# Altium project TestBoard.PrjPcb (part 4 of 5)

## Sheet Supply.SchDoc
size A4; SheetNumber: 2; SheetTotal: 3
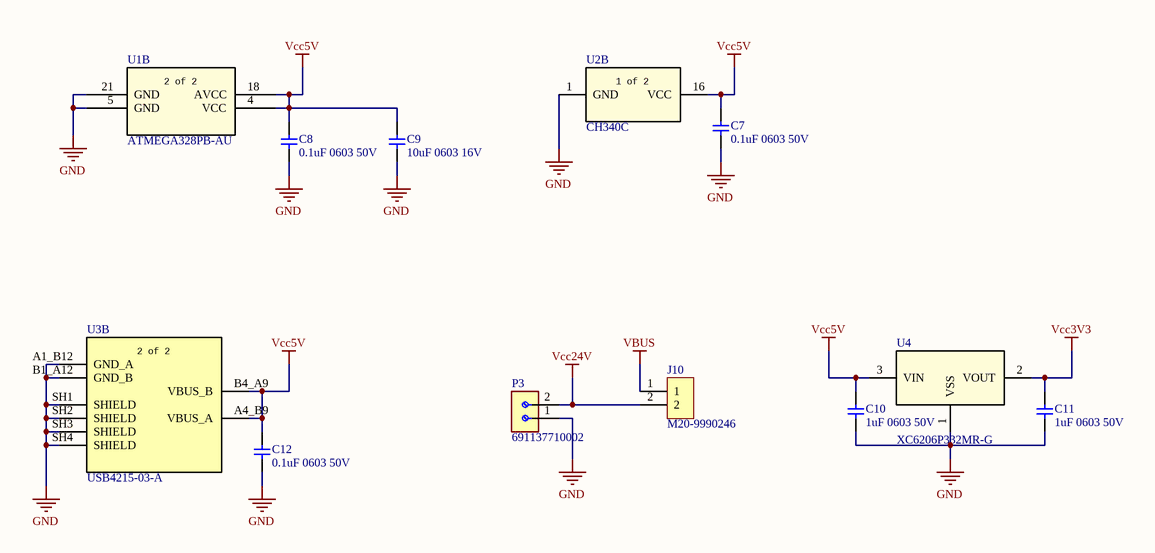
[diagram p1: Supply.SchDoc]

### Parts
C7  0.1uF 0603 50V  [CAP_0603]
C8  0.1uF 0603 50V  [CAP_0603]
C9  10uF 0603 16V  [CAP_0603]
C10  1uF 0603 50V  [CAP_0603]
C11  1uF 0603 50V  [CAP_0603]
C12  0.1uF 0603 50V  [CAP_0603]
J10  M20-9990246  [Header_Male_1x2_2.54mm]
P3  691137710002  [Termina_Block_1x2_5mm]
U1  ATMEGA328PB-AU  [TQFP-32]  (part B of 2)
U2  CH340C  [SOP-16]  (part B of 2)
U3  USB4215-03-A  [USB4215-03-A]  (part B of 2)
U4  XC6206P332MR-G  [SOT-23-3]

### Nets
GND: C7.1 C8.1 C9.1 C10.1 C11.1 C12.1 P3.1 U1.5(GND) U1.21(GND) U2.1(GND) U3.A1_B12(GND_A) U3.B1_A12(GND_B) U3.SH1(SHIELD) U3.SH2(SHIELD) U3.SH3(SHIELD) U3.SH4(SHIELD) U4.1(VSS)
VBUS: J10.1
Vcc3V3: C11.2 U4.2(VOUT)
Vcc5V: C7.2 C8.2 C9.2 C10.2 C12.2 U1.4(VCC) U1.18(AVCC) U2.16(VCC) U3.A4_B9(VBUS_A) U3.B4_A9(VBUS_B) U4.3(VIN)
Vcc24V: J10.2 P3.2

### Notes on the sheet
- (in symbol CMP-031-000005-2, part B) 1 of 2
- (in symbol CMP-036-000083-3, part B) 2 of 2
- (in symbol CMP-036-000093-2, part B) 2 of 2

### Library data of the parts
C7 C8 C12 = CMP-001-00088-6: 50V 0.1uF (100nF) X7R ±10% 0603 Multilayer Ceramic Capacitors MLCC - SMD/SMT ROHS; Manufacturer Part Number: CL10B104KB8NNNC; Manufacturer: Samsung Electro-Mechanics; ComponentLink8Description: https://datasheet.octopart.com/General-Multilayer-Ceramic-Capacitors-Samsung-datasheet-family-111.pdf; Thickness: 889µm; ComponentLink15Description: http://sigma.octopart.com:80/rohs_certificate/General-Multilayer-Ceramic-Capacitors-Samsung-family-110.pdf?src-supplier=Compliance+Statements; Lifecycle Status: Production; ComponentLink16Description: http://sigma.octopart.com:80/rohs_statement/General-Multilayer-Ceramic-Capacitors-Samsung-family-132.pdf?src-supplier=Compliance+Statements; ComponentLink9URL: https://datasheet.octopart.com:443/CL10B104KB8NNNC-Samsung-Electro-Mechanics-datasheet-136482302.pdf?src-supplier=Samsung+SCT; ComponentLink17URL: http://sigma.octopart.com:80/reach_statement/General-Multilayer-Ceramic-Capacitors-Samsung-family-133.pdf?src-supplier=Compliance+Statements; Schedule B: 8532240020, 8532240020; JLCPCB Part Number: C1591; Material: Ceramic; REACH SVHC: Yes; Width: 800µm; ComponentLink16URL: http://sigma.octopart.com:80/rohs_statement/General-Multilayer-Ceramic-Capacitors-Samsung-family-132.pdf?src-supplier=Compliance+Statements; Source: MySchLib.SchLib; ComponentLink12URL: https://datasheet.octopart.com:443/CL10B104KB8NNNC-Samsung-Electro-Mechanics-datasheet-149136784.pdf?src-supplier=Future+Electronics; ComponentLink7Description: https://datasheet.octopart.com/CL10B104KB8NNNC-Samsung-Electro-Mechanics-datasheet-97040617.pdf; ComponentLink14Description: https://datasheet.octopart.com:443/CL10B104KB8NNNC-Samsung-Electro-Mechanics-datasheet-11837008.pdf?src-supplier=Arrow+Electronics; Design Item ID: CL10B104KB8NNNC; ComponentLink1URL: https://datasheet.octopart.com:443/CL10B104KB8NNNC-Samsung-datasheet-165517828.pdf?src-supplier=Upverter; ComponentLink1Description: https://datasheet.octopart.com:443/CL10B104KB8NNNC-Samsung-datasheet-165517828.pdf?src-supplier=Upverter; Tolerance: 10%; Min Operating Temperature: -55°C; Max Operating Temperature: 125°C; ComponentLink3URL: https://datasheet.octopart.com:443/CL10B104KB8NNNC-Samsung-Electro-Mechanics-datasheet-81461840.pdf?src-supplier=Upverter; ComponentLink2URL: https://datasheet.octopart.com:443/CL10B104KB8NNNC-Samsung-Electro-Mechanics-datasheet-116890969.pdf?src-supplier=Upverter; Pin Count: 2; Voltage: 50V; Voltage Rating: 50V; Category: Ceramic Capacitors; ComponentLink9Description: https://datasheet.octopart.com:443/CL10B104KB8NNNC-Samsung-Electro-Mechanics-datasheet-136482302.pdf?src-supplier=Samsung+SCT; Dielectric Material: Ceramic; ComponentLink11URL: https://datasheet.octopart.com:443/CL10B104KB8NNNC-Samsung-datasheet-26589154.pdf?src-supplier=Future+Electronics; ComponentLink2Description: https://datasheet.octopart.com:443/CL10B104KB8NNNC-Samsung-Electro-Mechanics-datasheet-116890969.pdf?src-supplier=Upverter; Stock: 8176073; ComponentLink4URL: https://datasheet.octopart.com:443/CL10B104KB8NNNC-Samsung-Electro-Mechanics-datasheet-181551448.pdf?src-supplier=Newark; RoHS: Compliant; China RoHS: Compliant; ComponentLink17Description: http://sigma.octopart.com:80/reach_statement/General-Multilayer-Ceramic-Capacitors-Samsung-family-133.pdf?src-supplier=Compliance+Statements; Radiation Hardening: No; ComponentLink6URL: https://datasheet.octopart.com/CL10B104KB8NNNC-Samsung-Electro-Mechanics-datasheet-8324245.pdf; Voltage Rating (DC): 50V; Contact Plating: Tin; ComponentLink11Description: https://datasheet.octopart.com:443/CL10B104KB8NNNC-Samsung-datasheet-26589154.pdf?src-supplier=Future+Electronics; ComponentLink5URL: https://datasheet.octopart.com:443/CL10B104KB8NNNC-Samsung-Electro-Mechanics-datasheet-181551449.pdf?src-supplier=Newark; Lead Free: Lead Free; Dielectric: X7R; ComponentLink8URL: https://datasheet.octopart.com/General-Multilayer-Ceramic-Capacitors-Samsung-datasheet-family-111.pdf; Height: 900µm; ComponentLink12Description: https://datasheet.octopart.com:443/CL10B104KB8NNNC-Samsung-Electro-Mechanics-datasheet-149136784.pdf?src-supplier=Future+Electronics; Case Code (Imperial): 0603; Pricing: 1=0.1, 10=0.027, 50=0.018, 100=0.0153, 500=0.0108, 1000=0.00941 (USD); ComponentLink5Description: https://datasheet.octopart.com:443/CL10B104KB8NNNC-Samsung-Electro-Mechanics-datasheet-181551449.pdf?src-supplier=Newark; ComponentLink7URL: https://datasheet.octopart.com/CL10B104KB8NNNC-Samsung-Electro-Mechanics-datasheet-97040617.pdf; ComponentLink14URL: https://datasheet.octopart.com:443/CL10B104KB8NNNC-Samsung-Electro-Mechanics-datasheet-11837008.pdf?src-supplier=Arrow+Electronics; Value: 100nF; ComponentLink13URL: https://datasheet.octopart.com:443/CL10B104KB8NNNC-Samsung-datasheet-22147433.pdf?src-supplier=TME; Length: 1.6mm; ComponentLink10Description: https://datasheet.octopart.com:443/CL10B104KB8NNNC-Samsung-datasheet-42770373.pdf?src-supplier=Future+Electronics; Case/Package: 0603; ComponentLink4Description: https://datasheet.octopart.com:443/CL10B104KB8NNNC-Samsung-Electro-Mechanics-datasheet-181551448.pdf?src-supplier=Newark; ComponentLink6Description: https://datasheet.octopart.com/CL10B104KB8NNNC-Samsung-Electro-Mechanics-datasheet-8324245.pdf; Component Type: Standard; Number of Terminals: 2; Depth: 800µm; Case Code (Metric): 1608; Mounting Technology: Surface Mount; ComponentLink15URL: http://sigma.octopart.com:80/rohs_certificate/General-Multilayer-Ceramic-Capacitors-Samsung-family-110.pdf?src-supplier=Compliance+Statements; ComponentLink3Description: https://datasheet.octopart.com:443/CL10B104KB8NNNC-Samsung-Electro-Mechanics-datasheet-81461840.pdf?src-supplier=Upverter; ComponentLink10URL: https://datasheet.octopart.com:443/CL10B104KB8NNNC-Samsung-datasheet-42770373.pdf?src-supplier=Future+Electronics; ComponentLink13Description: https://datasheet.octopart.com:443/CL10B104KB8NNNC-Samsung-datasheet-22147433.pdf?src-supplier=TME
C9 = CMP-001-00087-6: 6.3V 10uF X5R ±20% 0603 Multilayer Ceramic Capacitors MLCC - SMD/SMT ROHS; Manufacturer: Samsung Electro-Mechanics; Manufacturer Part Number: CL10A106MQ8NNNC; Value: 10µF; Case Code (Metric): 1608; ComponentLink6Description: https://datasheet.octopart.com:443/CL10A106MQ8NNNC-Samsung-Electro-Mechanics-datasheet-81461793.pdf?src-supplier=Future+Electronics; Country of Origin: Mainland China, Philippines, South Korea; Introduction Date: 2006-12-13; Height: 800µm; Width: 800µm; RoHS: Compliant; Lifecycle Status: Production; Voltage Rating: 6.3V; Material: Ceramic; ComponentLink10Description: https://datasheet.octopart.com:443/CL10A106MQ8NNNC-Samsung-Electro-Mechanics-datasheet-149156487.pdf?src-supplier=Future+Electronics; ComponentLink11Description: https://datasheet.octopart.com:443/CL10A106MQ8NNNC-Samsung-datasheet-59220082.pdf?src-supplier=TME; Voltage: 6.3V; Mounting Technology: Surface Mount; Schedule B: 8532240020, 8532240020; Contact Plating: Tin; ComponentLink15URL: http://sigma.octopart.com:80/reach_statement/General-Multilayer-Ceramic-Capacitors-Samsung-family-133.pdf?src-supplier=Compliance+Statements; China RoHS: Compliant; ComponentLink13Description: http://sigma.octopart.com:80/rohs_certificate/General-Multilayer-Ceramic-Capacitors-Samsung-family-110.pdf?src-supplier=Compliance+Statements; ComponentLink8URL: https://datasheet.octopart.com:443/CL10A106MQ8NNNC-Samsung-datasheet-34157512.pdf?src-supplier=Future+Electronics; Design Item ID: CL10A106MQ8NNNC; ComponentLink3Description: https://datasheet.octopart.com/CL10A106MQ8NNNC-Samsung-Electro-Mechanics-datasheet-97040617.pdf; Min Operating Temperature: -55°C; Case/Package: 0603; ComponentLink12Description: https://datasheet.octopart.com:443/CL10A106MQ8NNNC-Samsung-Electro-Mechanics-datasheet-11784647.pdf?src-supplier=Arrow+Electronics; Stock: 84000; ComponentLink9URL: https://datasheet.octopart.com:443/CL10A106MQ8NNNC-Samsung-datasheet-26589122.pdf?src-supplier=Future+Electronics; ComponentLink2URL: https://datasheet.octopart.com/CL10A106MQ8NNNC-Samsung-Electro-Mechanics-datasheet-8324245.pdf; Length: 1.6mm; ComponentLink12URL: https://datasheet.octopart.com:443/CL10A106MQ8NNNC-Samsung-Electro-Mechanics-datasheet-11784647.pdf?src-supplier=Arrow+Electronics; Number of Terminals: 2; Export Control Classification Number (ECCN) Code: EAR99; ComponentLink15Description: http://sigma.octopart.com:80/reach_statement/General-Multilayer-Ceramic-Capacitors-Samsung-family-133.pdf?src-supplier=Compliance+Statements; ComponentLink11URL: https://datasheet.octopart.com:443/CL10A106MQ8NNNC-Samsung-datasheet-59220082.pdf?src-supplier=TME; Depth: 800µm; Dielectric: X5R; Voltage Rating (DC): 6.3V; ComponentLink10URL: https://datasheet.octopart.com:443/CL10A106MQ8NNNC-Samsung-Electro-Mechanics-datasheet-149156487.pdf?src-supplier=Future+Electronics; ComponentLink8Description: https://datasheet.octopart.com:443/CL10A106MQ8NNNC-Samsung-datasheet-34157512.pdf?src-supplier=Future+Electronics; ComponentLink14URL: http://sigma.octopart.com:80/rohs_statement/General-Multilayer-Ceramic-Capacitors-Samsung-family-132.pdf?src-supplier=Compliance+Statements; ComponentLink13URL: http://sigma.octopart.com:80/rohs_certificate/General-Multilayer-Ceramic-Capacitors-Samsung-family-110.pdf?src-supplier=Compliance+Statements; Thickness: 889µm; ComponentLink2Description: https://datasheet.octopart.com/CL10A106MQ8NNNC-Samsung-Electro-Mechanics-datasheet-8324245.pdf; Tolerance: 20%; ComponentLink7URL: https://datasheet.octopart.com:443/CL10A106MQ8NNNC-Samsung-datasheet-48647243.pdf?src-supplier=Future+Electronics; Radiation Hardening: No; Source: MySchLib.SchLib; JLCPCB Part Number: C1691; ComponentLink7Description: https://datasheet.octopart.com:443/CL10A106MQ8NNNC-Samsung-datasheet-48647243.pdf?src-supplier=Future+Electronics; Component Type: Standard; ComponentLink4URL: https://datasheet.octopart.com/General-Multilayer-Ceramic-Capacitors-Samsung-datasheet-family-111.pdf; Pin Count: 2; ComponentLink1Description: https://datasheet.octopart.com:443/CL10A106MQ8NNNC-Samsung-Electro-Mechanics-datasheet-136031759.pdf?src-supplier=IHS; ComponentLink3URL: https://datasheet.octopart.com/CL10A106MQ8NNNC-Samsung-Electro-Mechanics-datasheet-97040617.pdf; ComponentLink5Description: https://datasheet.octopart.com:443/CL10A106MQ8NNNC-Samsung-Electro-Mechanics-datasheet-110226293.pdf?src-supplier=Future+Electronics; ComponentLink1URL: https://datasheet.octopart.com:443/CL10A106MQ8NNNC-Samsung-Electro-Mechanics-datasheet-136031759.pdf?src-supplier=IHS; Pricing: 4000=0.195, 12000=0.185, 20000=0.176, 40000=0.169, 100000=0.165 (SEK); ComponentLink9Description: https://datasheet.octopart.com:443/CL10A106MQ8NNNC-Samsung-datasheet-26589122.pdf?src-supplier=Future+Electronics; REACH SVHC: Yes; Category: Ceramic Capacitors; Harmonized Tariff Schedule (HTS) Code: 8532.24.00.20; ComponentLink4Description: https://datasheet.octopart.com/General-Multilayer-Ceramic-Capacitors-Samsung-datasheet-family-111.pdf; Dielectric Material: Ceramic; ComponentLink6URL: https://datasheet.octopart.com:443/CL10A106MQ8NNNC-Samsung-Electro-Mechanics-datasheet-81461793.pdf?src-supplier=Future+Electronics; Max Operating Temperature: 85°C; ComponentLink5URL: https://datasheet.octopart.com:443/CL10A106MQ8NNNC-Samsung-Electro-Mechanics-datasheet-110226293.pdf?src-supplier=Future+Electronics; Case Code (Imperial): 0603; ComponentLink14Description: http://sigma.octopart.com:80/rohs_statement/General-Multilayer-Ceramic-Capacitors-Samsung-family-132.pdf?src-supplier=Compliance+Statements
C10 C11 = CMP-001-00086-6: 50V 1uF X5R ±10% 0603 Multilayer Ceramic Capacitors MLCC - SMD/SMT ROHS; Manufacturer: Samsung Electro-Mechanics; Manufacturer Part Number: CL10A105KB8NNNC; Value: 1µF; ComponentLink9Description: https://datasheet.octopart.com/CL10A105KB8NNNC-Samsung-Electro-Mechanics-datasheet-97040617.pdf; ComponentLink3URL: https://datasheet.octopart.com:443/CL10A105KB8NNNC-Samsung-Electro-Mechanics-datasheet-110326821.pdf?src-supplier=Future+Electronics; Dielectric: X5R; Case Code (Imperial): 0603; ComponentLink6URL: https://datasheet.octopart.com:443/CL10A105KB8NNNC-Samsung-datasheet-26589110.pdf?src-supplier=Future+Electronics; ComponentLink4Description: https://datasheet.octopart.com:443/CL10A105KB8NNNC-Samsung-Electro-Mechanics-datasheet-81461777.pdf?src-supplier=Future+Electronics; ComponentLink7Description: https://datasheet.octopart.com:443/CL10A105KB8NNNC-Samsung-datasheet-8328790.pdf?src-supplier=Future+Electronics; ComponentLink4URL: https://datasheet.octopart.com:443/CL10A105KB8NNNC-Samsung-Electro-Mechanics-datasheet-81461777.pdf?src-supplier=Future+Electronics; Voltage Rating: 50V; REACH SVHC: Yes; Width: 800µm; Radiation Hardening: No; RoHS: Compliant; Design Item ID: CL10A105KB8NNNC; Length: 1.6mm; ComponentLink8Description: https://datasheet.octopart.com:443/CL10A105KB8NNNC-Samsung-Electro-Mechanics-datasheet-149156476.pdf?src-supplier=Future+Electronics; ComponentLink2URL: https://datasheet.octopart.com:443/CL10A105KB8NNNC-Samsung-Electro-Mechanics-datasheet-136031745.pdf?src-supplier=Samsung+SCT; Component Type: Standard; Contact Plating: Tin; China RoHS: Compliant; ComponentLink11Description: https://datasheet.octopart.com:443/CL10A105KB8NNNC-Samsung-datasheet-59220082.pdf?src-supplier=TME; Stock: 1143081; Termination: Wraparound; Voltage Rating (DC): 50V; Tolerance: 10%; ComponentLink9URL: https://datasheet.octopart.com/CL10A105KB8NNNC-Samsung-Electro-Mechanics-datasheet-97040617.pdf; ComponentLink10Description: https://datasheet.octopart.com/CL10A105KB8NNNC-Samsung-Electro-Mechanics-datasheet-8324245.pdf; Dielectric Material: Ceramic; Category: Ceramic Capacitors; ComponentLink5URL: https://datasheet.octopart.com:443/CL10A105KB8NNNC-Samsung-datasheet-42485232.pdf?src-supplier=Future+Electronics; ComponentLink1Description: https://datasheet.octopart.com:443/CL10A105KB8NNNC-Samsung-Electro-Mechanics-datasheet-182019146.pdf?src-supplier=IHS; ComponentLink3Description: https://datasheet.octopart.com:443/CL10A105KB8NNNC-Samsung-Electro-Mechanics-datasheet-110326821.pdf?src-supplier=Future+Electronics; ComponentLink11URL: https://datasheet.octopart.com:443/CL10A105KB8NNNC-Samsung-datasheet-59220082.pdf?src-supplier=TME; ComponentLink6Description: https://datasheet.octopart.com:443/CL10A105KB8NNNC-Samsung-datasheet-26589110.pdf?src-supplier=Future+Electronics; Pricing: 1=0.11, 10=0.063, 50=0.0436, 100=0.0377, 500=0.02778, 1000=0.02472 (USD); Source: MySchLib.SchLib; Pin Count: 2; ComponentLink8URL: https://datasheet.octopart.com:443/CL10A105KB8NNNC-Samsung-Electro-Mechanics-datasheet-149156476.pdf?src-supplier=Future+Electronics; Material: Ceramic; Max Operating Temperature: 85°C; Number of Terminals: 2; Height: 900µm; Case Code (Metric): 1608; ComponentLink1URL: https://datasheet.octopart.com:443/CL10A105KB8NNNC-Samsung-Electro-Mechanics-datasheet-182019146.pdf?src-supplier=IHS; ComponentLink5Description: https://datasheet.octopart.com:443/CL10A105KB8NNNC-Samsung-datasheet-42485232.pdf?src-supplier=Future+Electronics; Thickness: 889µm; Min Operating Temperature: -55°C; JLCPCB Part Number: C15849; Packaging: Tape & Reel (TR); Schedule B: 8532240020, 8532240020; ComponentLink10URL: https://datasheet.octopart.com/CL10A105KB8NNNC-Samsung-Electro-Mechanics-datasheet-8324245.pdf; ComponentLink7URL: https://datasheet.octopart.com:443/CL10A105KB8NNNC-Samsung-datasheet-8328790.pdf?src-supplier=Future+Electronics; Depth: 800µm; Case/Package: 0603; Lifecycle Status: Production; ComponentLink2Description: https://datasheet.octopart.com:443/CL10A105KB8NNNC-Samsung-Electro-Mechanics-datasheet-136031745.pdf?src-supplier=Samsung+SCT; Mounting Technology: Surface Mount
J10 = CMP-002-00077-2: Header Male 1x2 2.54mm; Manufacturer: Harwin; Number of Positions: 2; Voltage Rating (AC): 750V; Connector Type: Male Pin; Max Current Rating: 3A; Contact Resistance: 30mO; Dielectric Material: Polyamide; Insulation Resistance: 1GO; JLCPCB Part Number: C90288; Max Operating Temperature: 105°C; Height: 8.99mm; REACH SVHC: Yes; Radiation Hardening: No; Color: Black; Housing Color: Black; ComponentLink3Description: https://datasheet.octopart.com:443/M20-9990246-Harwin-datasheet-96624206.pdf?src-supplier=element14+APAC; Terminal Pitch: 2.54mm; Export Control Classification Number (ECCN) Code: EAR99; Case/Package: SIL; Introduction Date: 2005-06-27; ComponentLink4Description: https://datasheet.octopart.com:443/M20-9990246-Harwin-datasheet-32864541.pdf?src-supplier=Farnell; ComponentLink5Description: https://datasheet.octopart.com:443/M20-9990246-Harwin-datasheet-7538443.pdf?src-supplier=Farnell; Mounting Technology: Through Hole; ComponentLink5URL: https://datasheet.octopart.com:443/M20-9990246-Harwin-datasheet-7538443.pdf?src-supplier=Farnell; Category: Headers and Wire Housings; Country of Origin: Taiwan; Pitch: 2.54mm; Length: 5.08mm; Pin Count: 2; Lifecycle Status: Production; Contact Mating Length: 6.096mm; Contact Plating: Tin; Termination: Solder; Number of Contacts: 2; Source: MySchLib.SchLib; ComponentLink6Description: https://datasheet.octopart.com:443/M20-9990246-Harwin-datasheet-508868.pdf?src-supplier=Farnell; Housing Material: Nylon; ComponentLink2URL: https://datasheet.octopart.com:443/M20-9990246-Harwin-datasheet-27378916.pdf?src-supplier=Newark; Number of Rows: 1; Current Rating: 3A; Depth: 2.54mm; Lead Pitch: 2.54mm; ComponentLink1URL: https://datasheet.octopart.com:443/M20-9990246-Harwin-datasheet-169407857.pdf?src-supplier=Newark; Min Operating Temperature: -40°C; ComponentLink6URL: https://datasheet.octopart.com:443/M20-9990246-Harwin-datasheet-508868.pdf?src-supplier=Farnell; Pricing: 1=0.1, 10=0.079, 100=0.0669, 500=0.0597, 1000=0.05684, 5000=0.05073, 10000=0.04831 (USD); Gender: Male; Stock: 105807; Contact Material: Brass; Design Item ID: M20-9990246; ComponentLink2Description: https://datasheet.octopart.com:443/M20-9990246-Harwin-datasheet-27378916.pdf?src-supplier=Newark; Pins: 2; ComponentLink1Description: https://datasheet.octopart.com:443/M20-9990246-Harwin-datasheet-169407857.pdf?src-supplier=Newark; Orientation: Straight; Component Type: Standard; Packaging: Bulk; RoHS: Compliant; ComponentLink3URL: https://datasheet.octopart.com:443/M20-9990246-Harwin-datasheet-96624206.pdf?src-supplier=element14+APAC; ComponentLink4URL: https://datasheet.octopart.com:443/M20-9990246-Harwin-datasheet-32864541.pdf?src-supplier=Farnell; Harmonized Tariff Schedule (HTS) Code: 8536.69.40.40; Manufacturer Part Number: M20-9990246
P3 = CMP-036-000080-3: Terminal Block, 5mm Pitch, Horizontal, Pressure Clamp Glow Wire, Pcb, 2PINS, Gr; Manufacturer: Wurth Elektronik; Number of Contacts: 2; Voltage Rating: 300V; Current Rating: 16A; Category: Terminal Blocks; Lead Pitch: 5mm; ComponentLink1Description: https://datasheet.octopart.com:443/691137710002-Wurth-Elektronik-datasheet-166323112.pdf?src-supplier=Wurth+Elektronik; Height: 11.5mm; Source: MySchLib.SchLib; Number of Rows: 1; ComponentLink2Description: https://datasheet.octopart.com:443/691137710002-W%C3%BCrth-Elektronik-datasheet-117282625.pdf?src-supplier=Wurth+Elektronik; ComponentLink3URL: https://datasheet.octopart.com:443/691137710002-W%C3%BCrth-Elektronik-datasheet-138898892.pdf?src-supplier=Upverter; Design Item ID: 691137710002; Stock: 24231; ComponentLink1URL: https://datasheet.octopart.com:443/691137710002-Wurth-Elektronik-datasheet-166323112.pdf?src-supplier=Wurth+Elektronik; Component Type: Standard; Pricing: 1=0.41, 10=0.363, 50=0.32, 100=0.287, 500=0.277 (USD); Max Operating Temperature: 110°C; RoHS: Compliant; Manufacturer Part Number: 691137710002; Min Operating Temperature: -30°C; Packaging: Box; Pins: 2; Pitch: 5mm; Contact Material: Nickel, Tin; ComponentLink3Description: https://datasheet.octopart.com:443/691137710002-W%C3%BCrth-Elektronik-datasheet-138898892.pdf?src-supplier=Upverter; Length: 10mm; JLCPCB Part Number: C3703; Pin Count: 2; ComponentLink2URL: https://datasheet.octopart.com:443/691137710002-W%C3%BCrth-Elektronik-datasheet-117282625.pdf?src-supplier=Wurth+Elektronik
U1 = CMP-036-000083-3: Manufacturer_Name: Microchip; Type: Type; Copyright: Copyright (C) 2025 Ultra Librarian. All rights reserved.; Design Item ID: ATMEGA328PB-AU_1; Manufacturer_Part_Number: ATMEGA328PB-AU; JLCPCB Part Number: C618731; RefDes: RefDes; Source: MySchLib.SchLib; Component Type: Standard; Pin Count: 32; PartId: 1
U2 = CMP-031-000005-2: USB to UART Serial Converter; JLCPCB Part Number: C84681; Component Type: Standard; Design Item ID: CH340C; Source: MySchLib.SchLib; Pin Count: 16; PartId: 2
U3 = CMP-036-000093-2: USB-C, 12+4 Contacts 16POS Rohs Compliant: Yes; Manufacturer: Global Connector Technology; Manufacturer Part Number: USB4215-03-A; Source: MySchLib.SchLib; ComponentLink1URL: https://datasheet.octopart.com:443/USB4215-03-A-GCT-datasheet-188869092.pdf?src-supplier=TME; ComponentLink2Description: https://datasheet.octopart.com:443/USB4215-03-A-GCT-datasheet-188936008.pdf?src-supplier=TME; Category: USB Connectors; ComponentLink2URL: https://datasheet.octopart.com:443/USB4215-03-A-GCT-datasheet-188936008.pdf?src-supplier=TME; Orientation: Horizontal; Design Item ID: USB4215-03-A; Pins: 16; JLCPCB Part Number: C165948; Component Type: Standard; Pin Count: 16; Pricing: 1=0.53, 10=0.449, 25=0.4208, 50=0.4006, 100=0.3814, 250=0.35752, 500=0.34044 (USD); Stock: 1071; ComponentLink1Description: https://datasheet.octopart.com:443/USB4215-03-A-GCT-datasheet-188869092.pdf?src-supplier=TME; PartId: 2
U4 = CMP-036-000094-3: LDO 3.3V 200mA; Manufacturer: Torex; Number of Channels: 1; Max Supply Voltage: 6V; Voltage Tolerance: 2%; Min Input Voltage: 1.8V; Max Operating Temperature: 85°C; Lifecycle Status: Production; Min Operating Temperature: -40°C; Source: MySchLib.SchLib; ComponentLink4Description: https://datasheet.octopart.com:443/XC6206P332MR-G-Torex-datasheet-30458793.pdf?src-supplier=Seeed+Studio; Pin Count: 3; Manufacturer Part Number: XC6206P332MR-G; ComponentLink3Description: https://datasheet.octopart.com:443/XC6206P332MR-G-Torex-datasheet-62046785.pdf?src-supplier=SHENGYU+ELECTRONICS; Pricing: 1=0.55, 10=0.384, 25=0.3432, 100=0.2987, 250=0.2774, 500=0.26456, 1000=0.25398 (USD); Case/Package: LSSOP; Category: LDO Voltage Regulators; Length: 2.9mm; Component Type: Standard; Height - Seated (Max): 1.3mm; ComponentLink1URL: https://datasheet.octopart.com:443/XC6206P332MR-G-Torex-datasheet-181386674.pdf?src-supplier=IHS; ComponentLink2URL: https://datasheet.octopart.com:443/XC6206P332MR-G-Torex-datasheet-134531119.pdf?src-supplier=TME; Stock: 6365; ComponentLink3URL: https://datasheet.octopart.com:443/XC6206P332MR-G-Torex-datasheet-62046785.pdf?src-supplier=SHENGYU+ELECTRONICS; Output Voltage: 3.3V; Number of Outputs: 1; ComponentLink2Description: https://datasheet.octopart.com:443/XC6206P332MR-G-Torex-datasheet-134531119.pdf?src-supplier=TME; Width: 1.6mm; ComponentLink4URL: https://datasheet.octopart.com:443/XC6206P332MR-G-Torex-datasheet-30458793.pdf?src-supplier=Seeed+Studio; Number of Circuits: 1; RoHS: Compliant; JLCPCB Part Number: C5446; ComponentLink1Description: https://datasheet.octopart.com:443/XC6206P332MR-G-Torex-datasheet-181386674.pdf?src-supplier=IHS; Number of Terminals: 3; Terminal Pitch: 950µm; Design Item ID: XC6206P332MR-G; REACH SVHC: Yes